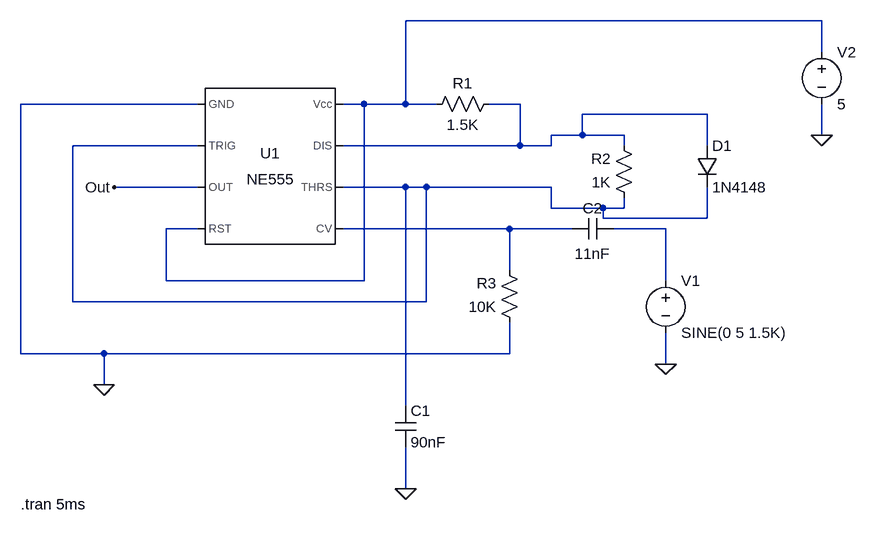
[diagram p0: schematic fm_mod.asc]
fm_mod.asc, the LTspice schematic file:
Version 4
SHEET 1 1112 712
WIRE 1056 -48 416 -48
WIRE 1056 0 1056 -48
WIRE 96 80 -176 80
WIRE 352 80 320 80
WIRE 416 80 416 -48
WIRE 416 80 352 80
WIRE 464 80 416 80
WIRE 592 80 544 80
WIRE 880 96 688 96
WIRE 688 128 688 96
WIRE 688 128 640 128
WIRE 752 128 688 128
WIRE 1056 128 1056 80
WIRE 96 144 -96 144
WIRE 592 144 592 80
WIRE 592 144 320 144
WIRE 640 144 640 128
WIRE 640 144 592 144
WIRE 752 144 752 128
WIRE 880 144 880 96
WIRE 96 208 -32 208
WIRE 416 208 320 208
WIRE 448 208 416 208
WIRE 640 208 448 208
WIRE 640 240 640 208
WIRE 720 240 640 240
WIRE 752 240 752 224
WIRE 752 240 720 240
WIRE 720 256 720 240
WIRE 880 256 880 208
WIRE 880 256 720 256
WIRE 96 272 48 272
WIRE 576 272 320 272
WIRE 672 272 576 272
WIRE 816 272 736 272
WIRE 576 336 576 272
WIRE 48 352 48 272
WIRE 352 352 352 80
WIRE 352 352 48 352
WIRE 816 352 816 272
WIRE -96 384 -96 144
WIRE 448 384 448 208
WIRE 448 384 -96 384
WIRE -176 464 -176 80
WIRE -48 464 -176 464
WIRE 576 464 576 416
WIRE 576 464 -48 464
WIRE 816 480 816 432
WIRE -48 512 -48 464
WIRE 416 544 416 208
WIRE 416 672 416 608
FLAG -32 208 Out
FLAG 816 480 0
FLAG -48 512 0
FLAG 416 672 0
FLAG 1056 128 0
SYMBOL Misc\\NE555 208 176 R0
SYMATTR InstName U1
SYMBOL res 560 64 R90
WINDOW 0 0 56 VBottom 2
WINDOW 3 32 56 VTop 2
SYMATTR InstName R1
SYMATTR Value 1.5K
SYMBOL res 768 240 R180
WINDOW 0 36 76 Left 2
WINDOW 3 36 40 Left 2
SYMATTR InstName R2
SYMATTR Value 1K
SYMBOL res 592 432 R180
WINDOW 0 36 76 Left 2
WINDOW 3 36 40 Left 2
SYMATTR InstName R3
SYMATTR Value 10K
SYMBOL cap 400 544 R0
SYMATTR InstName C1
SYMATTR Value 90nF
SYMBOL cap 672 288 R270
WINDOW 0 32 32 VTop 2
WINDOW 3 -7 32 VBottom 2
SYMATTR InstName C2
SYMATTR Value 11nF
SYMBOL diode 864 144 R0
SYMATTR InstName D1
SYMATTR Value 1N4148
SYMBOL voltage 816 336 R0
WINDOW 123 0 0 Left 0
WINDOW 39 0 0 Left 0
SYMATTR InstName V1
SYMATTR Value SINE(0 5 1.5K)
SYMBOL voltage 1056 -16 R0
WINDOW 123 0 0 Left 0
WINDOW 39 0 0 Left 0
SYMATTR InstName V2
SYMATTR Value 5
TEXT -176 696 Left 2 !.tran 5ms

The netlist it stands for:
* fm_mod.asc
XU1 0 N003 Out N001 N004 N003 N002 N001 NE555  ; pins GND TRIG OUT RST CV THRS DIS Vcc
R1 N002 N001 1.5K
R2 N003 N002 1K
R3 0 N004 10K
C1 N003 0 90nF
C2 N004 N005 11nF
D1 N002 N003 1N4148
V1 N005 0 SINE(0 5 1.5K)
V2 N001 0 5
.model D D
.lib standard.dio
.tran 5ms
.lib NE555.sub
.backanno
.end